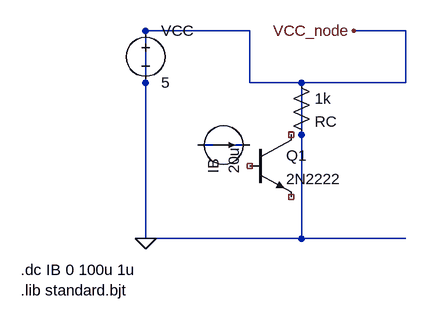
[diagram p0: schematic traceur_courbes.asc]
traceur_courbes.asc, the LTspice schematic file:
Version 4
SHEET 1 1000 800
WIRE 160 80 160 400
WIRE 320 80 160 80
WIRE 320 80 320 160
WIRE 560 80 480 80
WIRE 560 80 560 160
WIRE 160 400 560 400
WIRE 400 160 400 240
WIRE 320 160 400 160
WIRE 400 160 560 160
WIRE 400 240 400 400
WIRE 240 256 320 256
SYMBOL voltage 160 64 R0
WINDOW 123 0 0 Left 0
WINDOW 39 0 0 Left 0
SYMATTR InstName VCC
SYMATTR Value 5
SYMBOL res 384 144 R0
WINDOW 0 36 76 Left 2
WINDOW 3 36 40 Left 2
SYMATTR InstName RC
SYMATTR Value 1k
SYMBOL npn 320 240 R0
SYMATTR InstName Q1
SYMATTR Value 2N2222
SYMBOL current 240 256 R270
WINDOW 0 -44 24 Left 2
WINDOW 3 -44 56 Left 2
SYMATTR InstName IB
SYMATTR Value 20u
FLAG 160 400 0
FLAG 480 80 VCC_node
TEXT -32 448 Left 2 !.dc IB 0 100u 1u
TEXT -32 480 Left 2 !.lib standard.bjt

The netlist it stands for:
* traceur_courbes.asc
VCC 0 0 5
RC 0 0 1k
Q1 NC_01 NC_02 NC_03 0 2N2222
IB N001 N001 20u
.model NPN NPN
.model PNP PNP
.lib standard.bjt
.dc IB 0 100u 1u
.lib standard.bjt
.backanno
.end